# EAGLE schematic Project schematic (EAGLE 9.5.1)
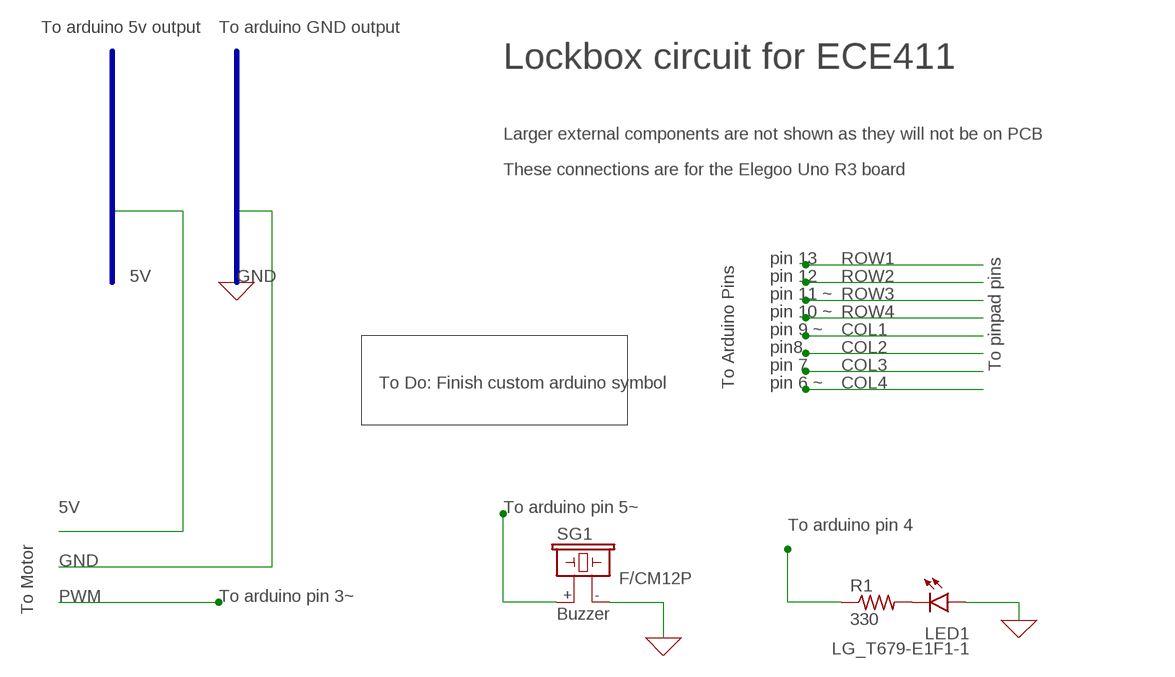
[diagram p0: schematic, sheet 1]

## Parts
LED1  LG_T679-E1F1-1  [PLCC2]
R1  330  R-US_0204/7  [0204/7]
SG1  F/CM12P  [F/CM12P]

## Nets
N$1: SG1.+
N$2: SG1.- ; supply symbol labelled GND
N$3: LED1.C R1.2
N$4: LED1.A ; supply symbol labelled GND
N$5: R1.1

## Buses
5V
GND

## Notes on the sheet
- To arduino 5v output | To arduino GND output
- Lockbox circuit for ECE411
- Larger external components are not shown as they will not be on PCB
- These connections are for the Elegoo Uno R3 board
- pin 13
- pin 12
- pin 11 ~
- pin 10 ~
- pin 9 ~
- pin8
- pin 7 | To pinpad pins
- To Do: Finish custom arduino symbol | To Arduino Pins | pin 6 ~
- To arduino pin 5~
- To arduino pin 4
- To arduino pin 3~
- To Motor
- Buzzer

## Library data of the parts
LED1 = led:*_T679-?-1: LC TOPLED® Low Current LED Source: http://catalog.osram-os.com .. LG_LS_LY_T679_OBS.pdf; COLOR: green
R1 = rcl:R-US_: RESISTOR, American symbol; SPICEPREFIX: R
SG1 = buzzer:F/CM12P: BUZZER Source: Buerklin; OC_FARNELL: unknown; OC_NEWARK: unknown